# Altium schematic sheet 01_Top.SchDoc: CM4 Tower part 2 Overview
size A2; Organization: Greenfield Tech Solutions; Address1: Molendreef 33; Address2: Ossendrecht; Address3: 4641CS; Address4: The Netherlands; SheetNumber: 1; SheetTotal: 11
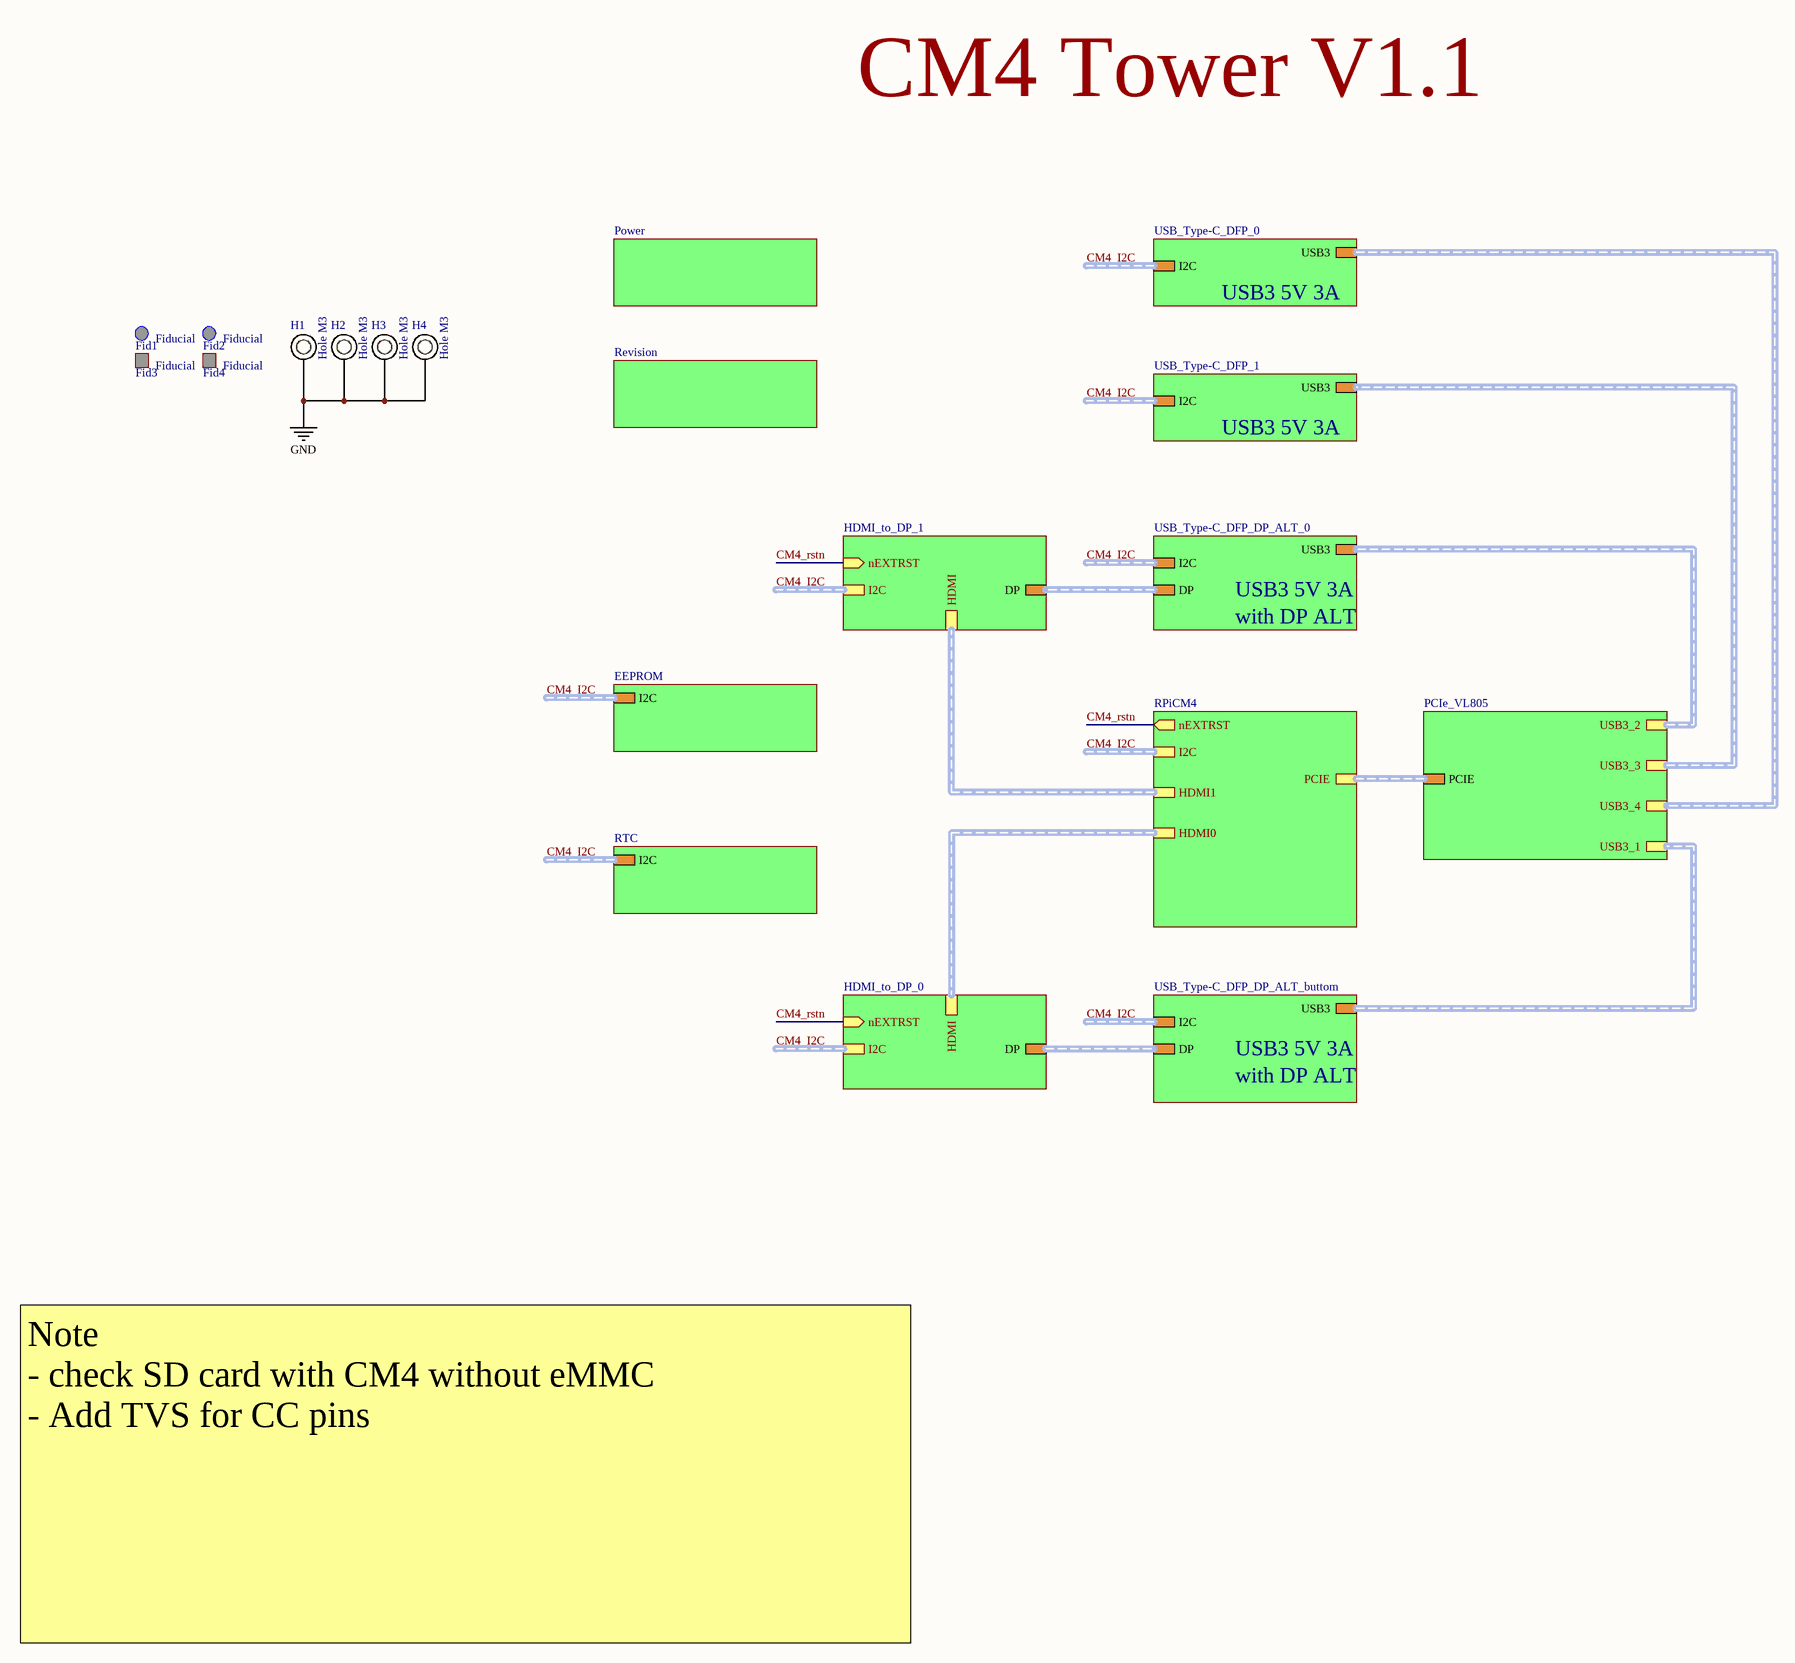
[diagram p0: 01_Top.SchDoc]

## Parts
Fid1  Fiducial  [FidR_1.0mm]  (no BOM)
Fid2  Fiducial  [FidR_1.0mm]  (no BOM)
Fid3  Fiducial  [FidS_1.0mm]  (no BOM)
Fid4  Fiducial  [FidS_1.0mm]  (no BOM)
H1  Hole M3  [HOLE_M3]  (no BOM)
H2  Hole M3  [HOLE_M3]  (no BOM)
H3  Hole M3  [HOLE_M3]  (no BOM)
H4  Hole M3  [HOLE_M3]  (no BOM)

## Sub-sheets
EEPROM = 10_EEPROM.SchDoc: I2C (harness I2C)
HDMI_to_DP_0 = 05_HDMI_to_DP.SchDoc: DP (harness DP), HDMI (harness HDMI), nEXTRST (in), I2C (harness I2C)
HDMI_to_DP_1 = 05_HDMI_to_DP.SchDoc: DP (harness DP), HDMI (harness HDMI), nEXTRST (in), I2C (harness I2C)
PCIe_VL805 = 04_PCIe_VL805.SchDoc: PCIE (harness PCIE), USB3_1 (harness USB3), USB3_2 (harness USB3), USB3_3 (harness USB3), USB3_4 (harness USB3)
Power = 02_Power.SchDoc: no entries
Revision = 11_Revision.SchDoc: no entries
RPiCM4 = 03_RPiCM4.SchDoc: I2C (harness I2C), PCIE (harness PCIE), HDMI0 (harness HDMI), HDMI1 (harness HDMI), nEXTRST (out)
RTC = 09_RTC.SchDoc: I2C (harness I2C)
USB_Type-C_DFP_0 = 06_USB_Type-C_DFP.SchDoc: USB3 (harness USB3), I2C (harness I2C)
USB_Type-C_DFP_1 = 06_USB_Type-C_DFP.SchDoc: USB3 (harness USB3), I2C (harness I2C)
USB_Type-C_DFP_DP_ALT_0 = 07_USB_Type-C_DFP_DP_ALT.SchDoc: USB3 (harness USB3), I2C (harness I2C), DP (harness DP)
USB_Type-C_DFP_DP_ALT_buttom = 08_USB_Type-C_DFP_DP_ALT_buttom.SchDoc: USB3 (harness USB3), I2C (harness I2C), DP (harness DP)

## Nets
GND: H1.1 H2.1 H3.1 H4.1
CM4_rstn: sheet RPiCM4/nEXTRST, sheet HDMI_to_DP_0/nEXTRST, sheet HDMI_to_DP_1/nEXTRST

## Buses and harness runs
harness CM4_I2C = sheet EEPROM/I2C
harness CM4_I2C = sheet HDMI_to_DP_0/I2C
harness CM4_I2C = sheet HDMI_to_DP_1/I2C
harness CM4_I2C = sheet RPiCM4/I2C
harness CM4_I2C = sheet RTC/I2C
harness CM4_I2C = sheet USB_Type-C_DFP_0/I2C
harness CM4_I2C = sheet USB_Type-C_DFP_1/I2C
harness CM4_I2C = sheet USB_Type-C_DFP_DP_ALT_0/I2C
harness CM4_I2C = sheet USB_Type-C_DFP_DP_ALT_buttom/I2C
harness sheet HDMI_to_DP_0/DP = sheet USB_Type-C_DFP_DP_ALT_buttom/DP
harness sheet HDMI_to_DP_0/HDMI = sheet RPiCM4/HDMI0
harness sheet HDMI_to_DP_1/DP = sheet USB_Type-C_DFP_DP_ALT_0/DP
harness sheet HDMI_to_DP_1/HDMI = sheet RPiCM4/HDMI1
harness sheet PCIe_VL805/PCIE = sheet RPiCM4/PCIE
harness sheet PCIe_VL805/USB3_1 = sheet USB_Type-C_DFP_DP_ALT_buttom/USB3
harness sheet PCIe_VL805/USB3_2 = sheet USB_Type-C_DFP_DP_ALT_0/USB3
harness sheet PCIe_VL805/USB3_3 = sheet USB_Type-C_DFP_1/USB3
harness sheet PCIe_VL805/USB3_4 = sheet USB_Type-C_DFP_0/USB3

## Notes on the sheet
- CM4 Tower V1.1
- USB3 5V 3A
- with DP ALT
- Note
  - check SD card with CM4 without eMMC
  - Add TVS for CC pins
- Title
- Size:
- Date:
- File:
- A2
- Number:
- Time:
- Revision:
- Sheet
- of

## Library data of the parts
Fid1 Fid2 = ME0011: Fiducial Round 1mm; Part Number: ME0011; ID: 11; RefVal: Fiducial
Fid3 Fid4 = ME0012: Fiducial Sqaure 1mm; Part Number: ME0012; ID: 12; RefVal: Fiducial
H1-H4 = ME0001: Mounting Hole M3; Part Number: ME0001; ID: 1; RefVal: Hole M3